# EasyEDA schematic hygrometer-probe.json
TITLE: Sheet_1; REV: 1.0; Date: 2023-07-07; Sheet: 1/1; Company: Your Company
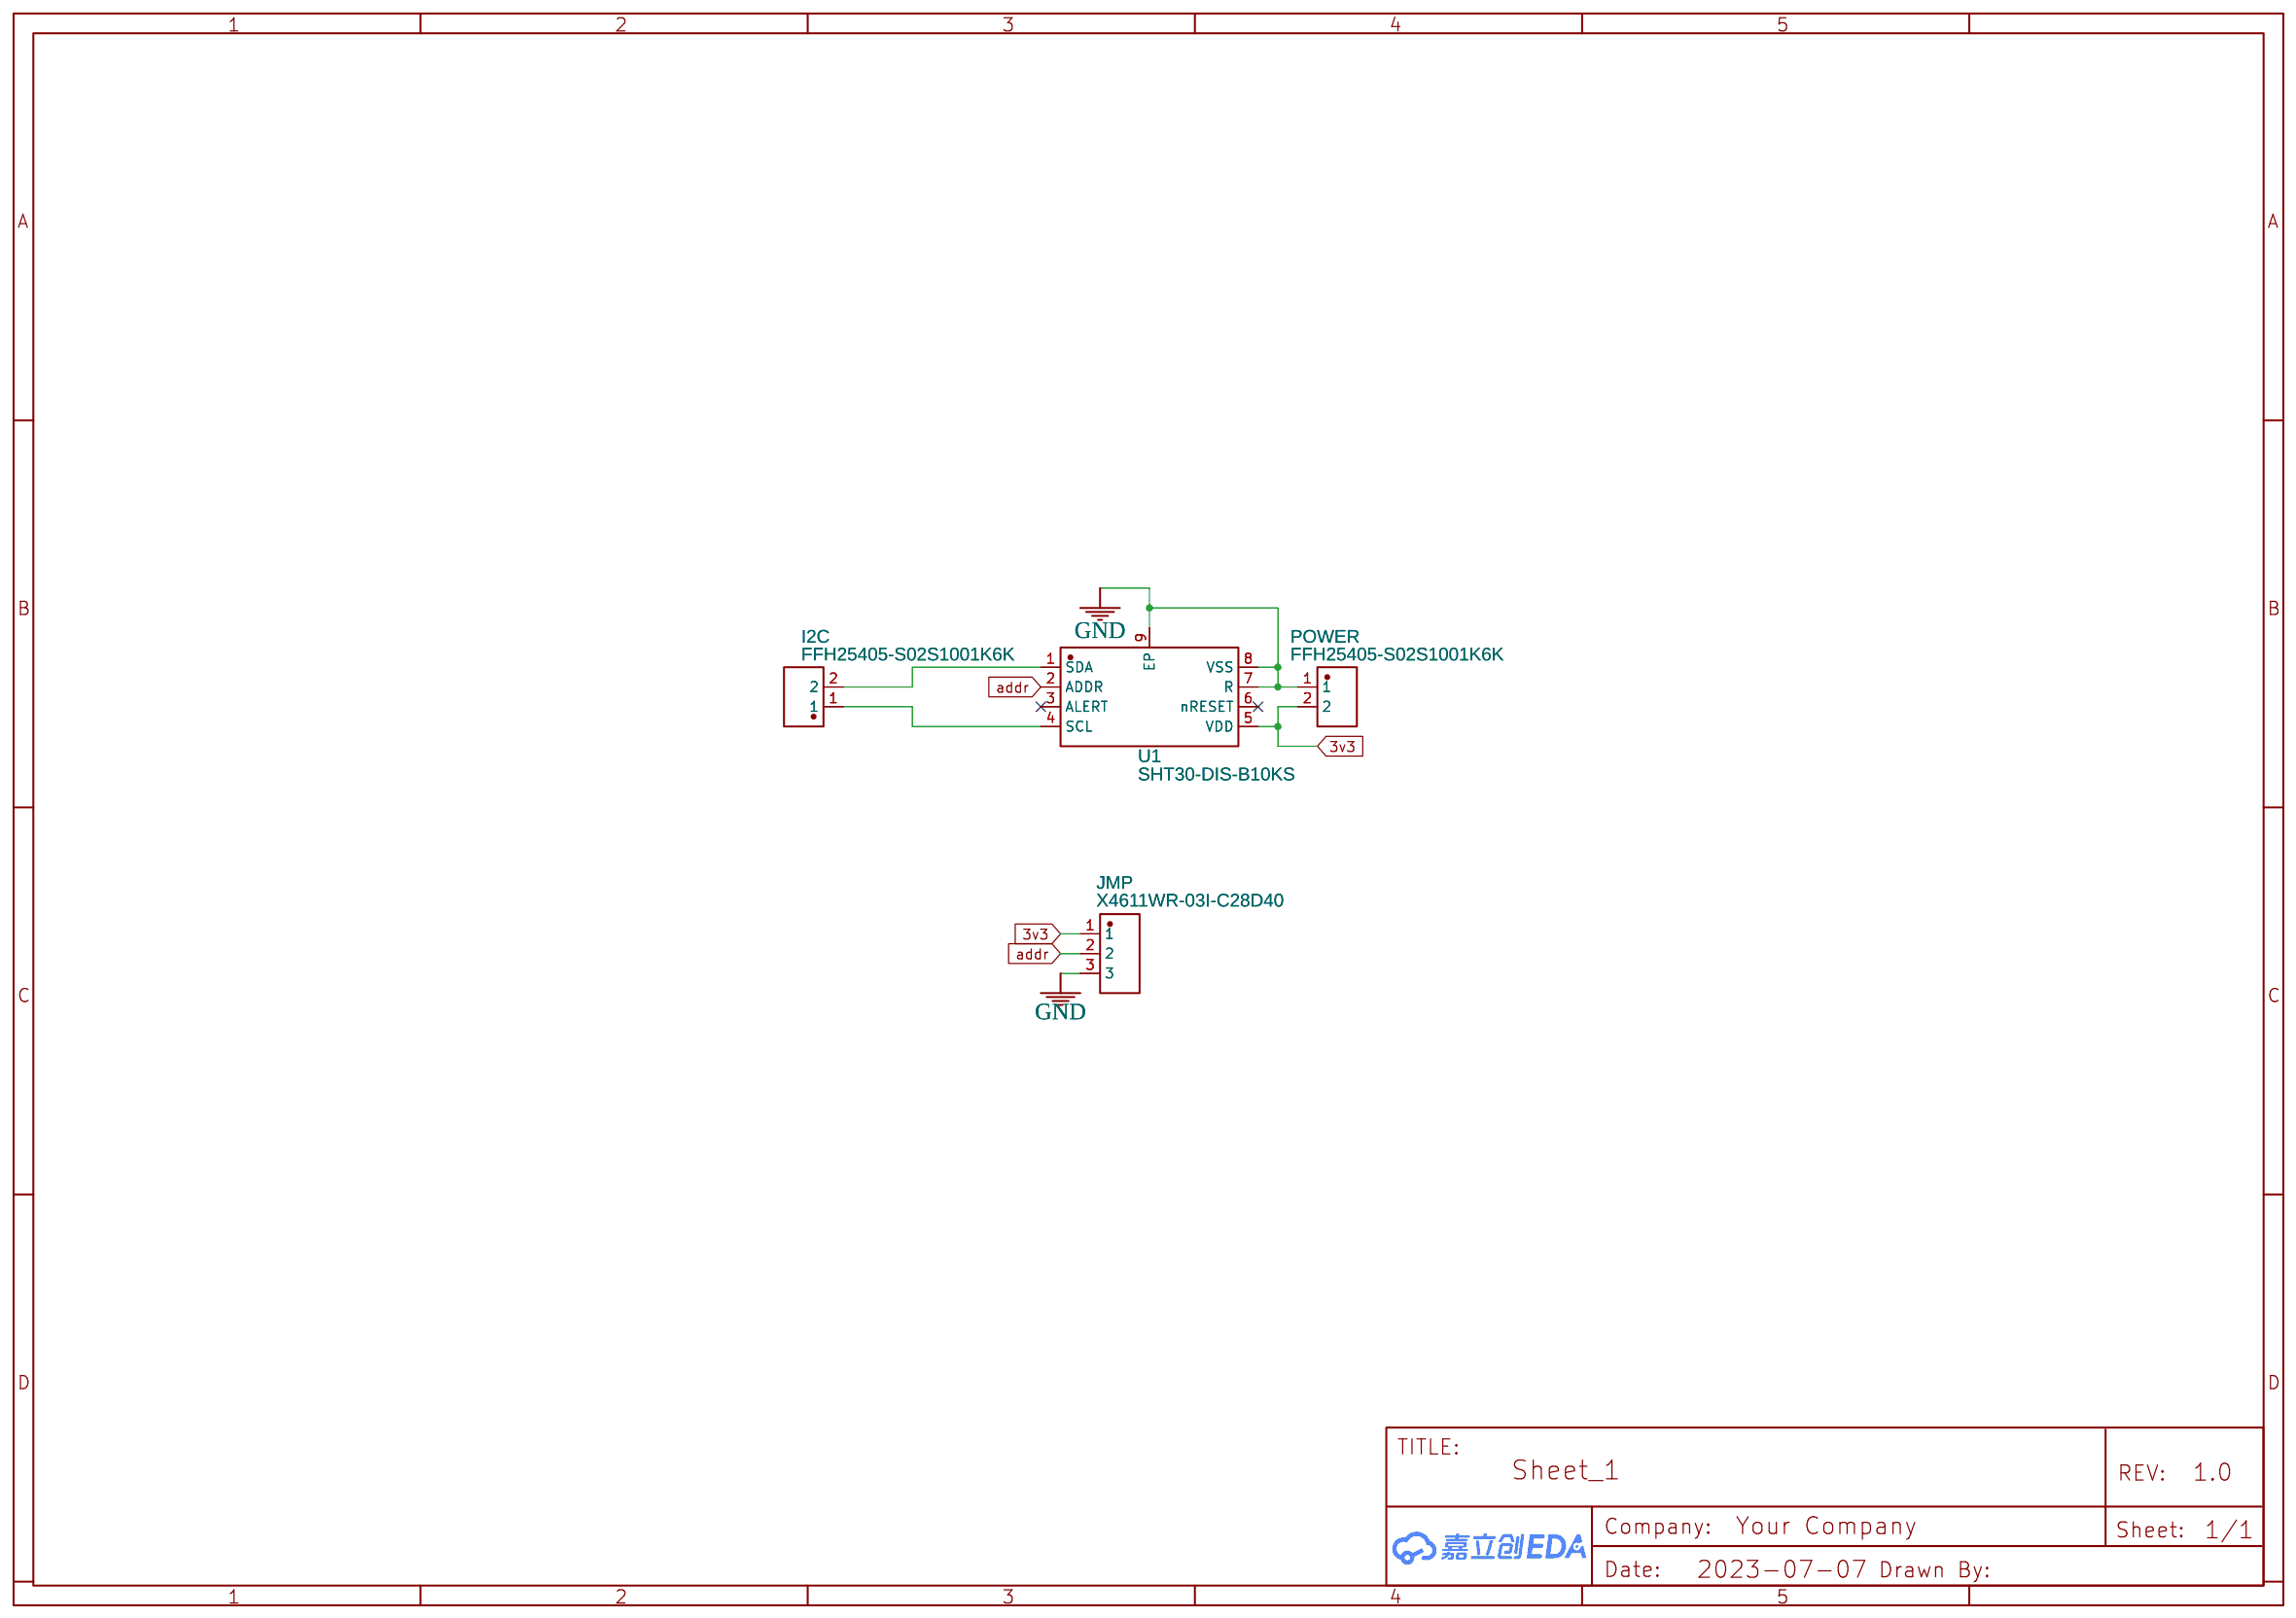
[diagram p0: schematic sheet]

## Parts
I2C  FFH25405-S02S1001K6K  [HDR-TH_2P-P2.54-V-F_FFH25405]
JMP  X4611WR-03I-C28D40  [HDR-TH_3P-P2.00-H-M-W7.2]
POWER  FFH25405-S02S1001K6K  [HDR-TH_2P-P2.54-V-F_FFH25405]
U1  SHT30-DIS-B10KS  [DFN-8_L2.5-W2.5-P0.50-BL-EP]

## Library data of the parts
I2C POWER = FFH25405-S02S1001K6K: Supplier: LCSC; Supplier Part: C2833813; Manufacturer: TXGA(特思嘉); Contributor: LCSC; JLCPCB Part Class: Extended Part
JMP = X4611WR-03I-C28D40: Supplier: LCSC; Supplier Part: C707012; Manufacturer: XKB Connectivity(中国星坤); Contributor: LCSC; JLCPCB Part Class: Extended Part
U1 = SHT30-DIS-B10KS: Supplier: LCSC; Supplier Part: C2687423; Manufacturer: Sensirion(瑞士盛思锐); Contributor: LCSC; JLCPCB Part Class: Extended Part

## Nets
3v3: JMP.1 POWER.2 U1.5(VDD)
GND: JMP.3 POWER.1 U1.7(R) U1.8(VSS) U1.9(EP)
addr: JMP.2 U1.2(ADDR)
Net-(I2C-1): I2C.1 U1.4(SCL)
Net-(I2C-2): I2C.2 U1.1(SDA)

Not connected (* = marked no-connect by the designer): U1 3(ALERT)* 6(nRESET)*
